# Altium schematic sheet Instrumentation_Amp.SchDoc
size A4; SheetNumber: 3; SheetTotal: 7
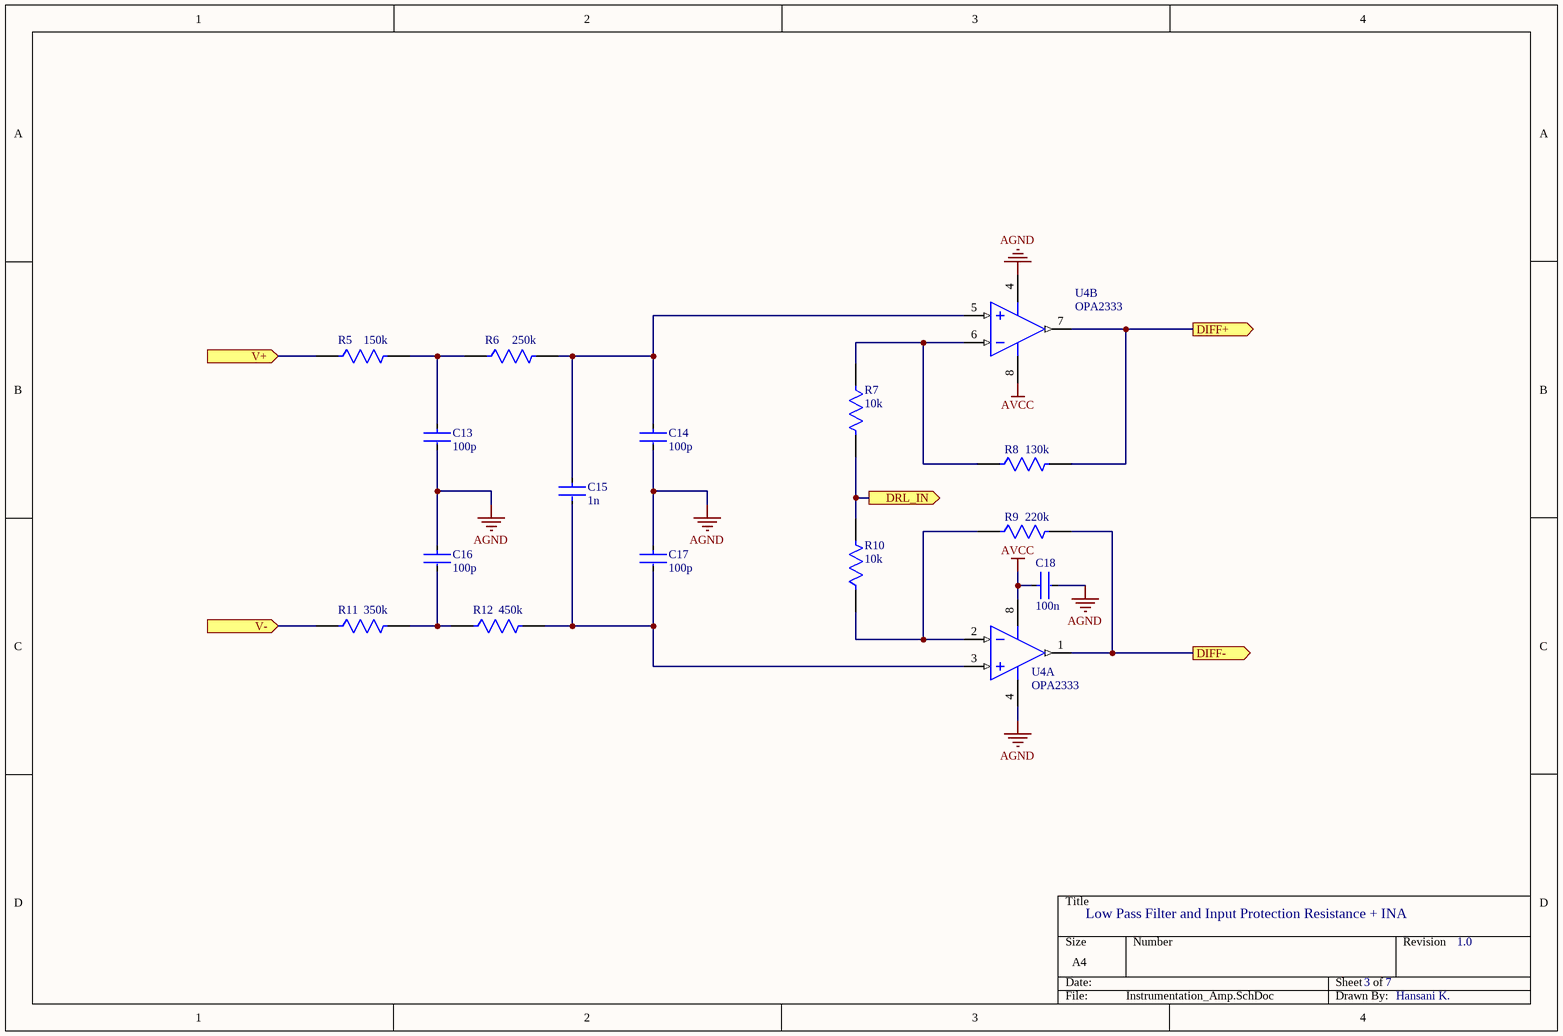
[diagram p0: Instrumentation_Amp.SchDoc]

## Parts
C13  100p  [FP-CC0805-0_1-0_7-IPC_A]
C14  100p  [FP-CC0805-0_1-0_7-IPC_A]
C15  1n  [PCBComponent_1]
C16  100p  [FP-CC0805-0_1-0_7-IPC_A]
C17  100p  [FP-CC0805-0_1-0_7-IPC_A]
C18  100n  [FP-GRM155-0_05-MFG]
R5  150k  [PCBComponent_1]
R6  250k  [PCBComponent_1]
R7  10k  [FP-AT0805-MFG]
R8  130k  [FP-RN732A-MFG]
R9  220k  [FP-CRCW0805-e3-IPC_B]
R10  10k  [FP-AT0805-MFG]
R11  350k  [PCBComponent_1]
R12  450k  [PCBComponent_1]
U4  OPA2333  [DGK0008A_M]  (parts A,B of 2)

## Ports
DIFF+ (out, see Wireless_ECG_Monitor[2B], Input_Driver_ADC[1B]), DIFF- (out, see Wireless_ECG_Monitor[2B], Input_Driver_ADC[1C]), DRL_IN (out, see Wireless_ECG_Monitor[2B], DRL_Circuit[2C]), V+ (in, see Wireless_ECG_Monitor[1B]), V- (in, see Wireless_ECG_Monitor[1B])

## Nets
AGND: C13.2 C14.2 C16.1 C17.1 C18.2 U4.4(V-)
AVCC: C18.1 U4.8(V+)
DIFF+: R8.2 U4.7(OUT_B) ; port DIFF+
DIFF-: R9.2 U4.1(OUT_A) ; port DIFF-
DRL_IN: R7.2 R10.2 ; port DRL_IN
V+: R5.1 ; port V+
V-: R11.1 ; port V-
NetC13_1: C13.1 R5.2 R6.1
NetC14_1: C14.1 C15.1 R6.2 U4.5(IN_B+)
NetC15_2: C15.2 C17.2 R12.2 U4.3(IN_A+)
NetC16_2: C16.2 R11.2 R12.1
NetR7_1: R7.1 R8.1 U4.6(IN_B-)
NetR9_1: R9.1 R10.1 U4.2(IN_A-)

## Notes on the sheet
- Low Pass Filter and Input Protection Resistance + INA
- 3
- 7
- 1.0
- Hansani K.

## Library data of the parts
C13 C14 C16 C17 = CMP-03422-001508-1: CAP CER 100PF 50V C0G/NPO 0805; Insulation Resistance: 100GR; Dielectric: C0G; Temperature Coefficient: 30ppm/°C; Dielectric Material: Ceramic; Tolerance: 5%; REACH SVHC: No SVHC; Packaging: Tape and Reel; Max Operating Temperature: 125°C; Case Code (Imperial): 0805; Number of Pins: 2; Height: 0.6mm; Case/Package: 0805; Resistor Type: Ceramic; Length: 2mm; Width: 1.25mm; RoHS Compliant: Yes; Thickness: 0.024inch; Case Code (Metric): 2012; Radiation Hardening: No; Series: CC; Package Quantity: 1; Voltage: 50V; Voltage Rating (DC): 50V; Capacitance: 100pF; Mount: Surface Mount; Voltage Rating: 50V; Min Operating Temperature: -55°C; Lead Free: Lead Free; Termination: SMD/SMT; Depth: 1.25mm
C15 = CS0805KRX7RBBB102: Ceramic Capacitor, Multilayer, Ceramic, 500V, 10% +Tol, 10% -Tol, X7R, 15% TC, 0.001uF, Surface Mount, 0805; Manufacturer: Yageo Group; Value: 1nF; Supplier: DigiKey; Supplier Part Number: 311-3593-1-ND; Manufacturer Part Number: CS0805KRX7RBBB102; RoHS: Compliant; Category: Ceramic Capacitors; Stock: 13349; Pricing: 1=0.32, 10=0.191, 50=0.14, 100=0.1241, 500=0.0976, 1000=0.08941 (USD); Case/Package: 0805; China RoHS: Compliant; Dielectric Material: Ceramic; Features: Soft Termination; Height: 850µm; Length: 2mm; Lifecycle Status: Production; Max Operating Temperature: 125°C; Min Operating Temperature: -55°C; Mounting Technology: Surface Mount; Number of Terminals: 2; REACH SVHC: Yes; Thickness: 990.6µm; Tolerance: 10%; Voltage Rating: 500V; Voltage Rating (DC): 500V; Width: 1.25mm; ComponentLink1URL: https://datasheet.octopart.com:443/CS0805KRX7RBBB102-Yageo-datasheet-176133326.pdf?src-supplier=IHS; ComponentLink1Description: https://datasheet.octopart.com:443/CS0805KRX7RBBB102-Yageo-datasheet-176133326.pdf?src-supplier=IHS; ComponentLink2URL: https://datasheet.octopart.com:443/CS0805KRX7RBBB102-Yageo-datasheet-158410602.pdf?src-supplier=Newark; ComponentLink2Description: https://datasheet.octopart.com:443/CS0805KRX7RBBB102-Yageo-datasheet-158410602.pdf?src-supplier=Newark; ComponentLink3URL: https://datasheet.octopart.com:443/CS0805KRX7RBBB102-Yageo-datasheet-182050863.pdf?src-supplier=Newark; ComponentLink3Description: https://datasheet.octopart.com:443/CS0805KRX7RBBB102-Yageo-datasheet-182050863.pdf?src-supplier=Newark; ComponentLink4URL: http://sigma.octopart.com:80/rohs_statement/Yageo-company-2.pdf?src-supplier=Compliance+Statements; ComponentLink4Description: http://sigma.octopart.com:80/rohs_statement/Yageo-company-2.pdf?src-supplier=Compliance+Statements; ComponentLink5URL: http://sigma.octopart.com:80/conflict_mineral_statement/Yageo-company-3.pdf?src-supplier=Compliance+Statements; ComponentLink5Description: http://sigma.octopart.com:80/conflict_mineral_statement/Yageo-company-3.pdf?src-supplier=Compliance+Statements
C18 = CMP-06035-040303-1: Chip Multilayer Ceramic Capacitors for General Purpose, 0402, 0.10uF, B, 10%, 20%, 50V
R5 R11 = ERJ-6GEYJ354V: ERJ Thick Film Chip Resistor 0805 350K Ohm 5% 0.125 W 2-Pin Surface Mount Punched Carrier T/R; Manufacturer: Panasonic; Max Power Dissipation: 125mW; Value: 350kΩ; Temperature Coefficient: 200ppm/°C; Supplier: DigiKey; Supplier Part Number: ERJ-6GEYJ354V-ND; Manufacturer Part Number: ERJ-6GEYJ354V; RoHS: Compliant; Category: Chip SMD Resistors; Pricing: 50000=0.00673 (USD); Case/Package: 0805; Composition: Thick Film; Contact Plating: Tin; Features: Automotive AEC-Q200; Height: 711.2µm; Length: 2.0066mm; Max Operating Temperature: 155°C; Min Operating Temperature: -55°C; Number of Terminations: 2; Packaging: Tape & Reel; Power Rating: 125mW; Radiation Hardening: No; Tolerance: 5%; Width: 1.2446mm; ComponentLink1URL: https://datasheet.octopart.com/ERJ-6GEYJ354V-Panasonic-datasheet-78375410.pdf; ComponentLink1Description: https://datasheet.octopart.com/ERJ-6GEYJ354V-Panasonic-datasheet-78375410.pdf; ComponentLink2URL: https://datasheet.octopart.com/Thick-Film-Chip-Resistors-Panasonic-datasheet-family-105.pdf; ComponentLink2Description: https://datasheet.octopart.com/Thick-Film-Chip-Resistors-Panasonic-datasheet-family-105.pdf
R6 = RNCF0805BTE250K: RNCF Precision Thin Film Chip Resistor 0805 Size 250K Ohm 0.1% 0.25 W 25 ppm/°C 2-Pin SMD T/R; Manufacturer: Stackpole Electronics; Power Dissipation: 125mW; Power Rating: 100mW; Value: 250kΩ; Working Voltage: 150V; Supplier: DigiKey; Supplier Part Number: 738-RNCF0805BTE250KCT-ND; Manufacturer Part Number: RNCF0805BTE250K; RoHS: Compliant; Category: Chip SMD Resistors; Stock: 8430; Pricing: 1=0.12, 10=0.087, 25=0.0852, 50=0.083, 100=0.077, 250=0.07292, 500=0.06918 (USD); Case/Package: 0805; China RoHS: Compliant; Height: 500µm; Lifecycle Status: Production; Max Operating Temperature: 155°C; Min Operating Temperature: -55°C; Mounting Technology: Surface Mount; Number of Terminals: 2; REACH SVHC: Yes; Temperature Coefficient: 25ppm/°C; Tolerance: 0.1%; Width: 1.25mm; ComponentLink1URL: https://datasheet.octopart.com:443/RNCF0805BTE250K-Stackpole-Electronics-datasheet-141158876.pdf?src-supplier=Stackpole+Electronics; ComponentLink1Description: https://datasheet.octopart.com:443/RNCF0805BTE250K-Stackpole-Electronics-datasheet-141158876.pdf?src-supplier=Stackpole+Electronics; ComponentLink2URL: https://datasheet.octopart.com:443/RNCF0805BTE250K-Stackpole-Electronics-datasheet-12511394.pdf?src-supplier=Stackpole+Electronics; ComponentLink2Description: https://datasheet.octopart.com:443/RNCF0805BTE250K-Stackpole-Electronics-datasheet-12511394.pdf?src-supplier=Stackpole+Electronics; ComponentLink3URL: https://datasheet.octopart.com:443/RNCF0805BTE250K-Stackpole-Electronics-datasheet-182148138.pdf?src-supplier=IHS; ComponentLink3Description: https://datasheet.octopart.com:443/RNCF0805BTE250K-Stackpole-Electronics-datasheet-182148138.pdf?src-supplier=IHS; ComponentLink4URL: https://datasheet.octopart.com/RNCF0805BTE250K-Stackpole-Electronics-datasheet-11755897.pdf; ComponentLink4Description: https://datasheet.octopart.com/RNCF0805BTE250K-Stackpole-Electronics-datasheet-11755897.pdf; ComponentLink5URL: http://sigma.octopart.com:80/15941409/materials_sheet/Stackpole-Electronics-RNCF0805BTE250K.pdf?src-supplier=Compliance+Statements; ComponentLink5Description: http://sigma.octopart.com:80/15941409/materials_sheet/Stackpole-Electronics-RNCF0805BTE250K.pdf?src-supplier=Compliance+Statements; ComponentLink6URL: http://sigma.octopart.com:80/141158211/reach_statement/Stackpole-Electronics-RNCF0805BTE250K.pdf?src-supplier=Compliance+Statements; ComponentLink6Description: http://sigma.octopart.com:80/141158211/reach_statement/Stackpole-Electronics-RNCF0805BTE250K.pdf?src-supplier=Compliance+Statements; ComponentLink7URL: http://sigma.octopart.com:80/141158212/rohs_statement/Stackpole-Electronics-RNCF0805BTE250K.pdf?src-supplier=Compliance+Statements; ComponentLink7Description: http://sigma.octopart.com:80/141158212/rohs_statement/Stackpole-Electronics-RNCF0805BTE250K.pdf?src-supplier=Compliance+Statements
R7 R10 = CMP-03412-049031-1: Thin Film Chip Resistors Automotive Grade 10kΩ 0.5% 50ppm/°C 0805; Max Power Dissipation: 125mW; Resistance: 10kR; Ratings: AEC-Q200; Length: 0.079inch; Temperature Coefficient: 50ppm/°C; Height: 0.024inch; Min Operating Temperature: -55°C; Case/Package: 0805; Tolerance: 0.5%; RoHS Compliant: Yes; Features: Moisture Resistant; Number of Terminations: 2; Max Operating Temperature: 155°C; Series: AT; Packaging: Tape and Reel; Width: 0.049inch; Resistor Type: Thin Film
R8 = CMP-03211-005013-1: SMD Chip Resistor, Thin Film, 130KΩ, 100 V, 0805 [2012 Metric], 100 mW, 0.1%, RN73 Series; Manufacturer: TE Connectivity; Manufacturer Part Number: RN73C2A130KB; Voltage Rating: 100V; Temperature Coefficient: 10ppm/°C; Power Rating: 0.1W; Temperature: -55°C to 155°C; Device Class L3: Chip SMD Resistors; octopart_url: https://octopart.com/rn73c2a130kb-te+connectivity-47108236; Device Class L1: Passive Components; Ipc Land Pattern Name: RESC200125X55; Composition: Thin Film; Resistance: 130KΩ; ComponentLink2Description: Datasheet; RoHS: TRUE; Automotive: No; Temperature Range Low: -55°C; Tolerance: 0.1%; Category: Res; Value: 130KΩ; Temperature Range High: 155°C; ComponentLink2URL: https://www.te.com/commerce/DocumentDelivery/DDEController?Action=showdoc&DocId=Data+Sheet%7F1773270%7FP%7Fpdf%7FEnglish%7FENG_DS_1773270_P.pdf%7F1676162-2; Device Class L2: Resistors; Series: RN73; Height: 0.65mm; Package: RN732A; Lead Free: Yes; Octopart: https://octopart.com/rn73c2a130kb-te+connectivity-47108236; packaging: Custom
R9 = CMP-02407-007376-1: RES Thick Film, 220kΩ, 1%, 0.125W, 100ppm/°C, 0805; Max Power Dissipation: 125mW; Resistance: 220kR; Width: 0.049inch; Composition: Thick Film; Max Operating Temperature: 155°C; Min Operating Temperature: -55°C; Length: 0.079inch; Package Quantity: 20000; Features: Automotive AEC-Q200; Packaging: Tape and Reel; Height: 0.02inch; Case/Package: 0805; Temperature Coefficient: 100ppm/°C; Lead Free: Lead Free; Number of Terminations: 2; Tolerance: 1%
R12 = RMK55N450KB: Rmk 55N 450K 0, 1% E /Waffle Pack |Vishay RMK55N450KB; Manufacturer: Vishay; Supplier: DigiKey; Supplier Part Number: 716-RMK55N450KB-ND; Manufacturer Part Number: RMK55N450KB; Category: Chip SMD Resistors; Pricing: 100=17.6562 (USD); RoHS: Non-Compliant; ComponentLink1URL: http://sigma.octopart.com:80/rohs_statement/Vishay-company-15.pdf?src-supplier=Compliance+Statements; ComponentLink1Description: http://sigma.octopart.com:80/rohs_statement/Vishay-company-15.pdf?src-supplier=Compliance+Statements
U4 = CMP-0272-01196-3: 17 uA, MicroPower, Precision, Zero Drift CMOS Operational Amplifier, 1.8 to 5.5 V, -40 to 125 degC, 8-pin SOP (DGK8), Green (RoHS & no Sb/Br); Manufacturer: Texas Instruments; PartNumber: OPA2333AIDGKR; CMRR(Min)(dB): 106; IIB(Max)(pA): 200; Slew Rate(Typ)(V/us): 0.16; Sub Family: Low Offset Voltage Amplifier (<=500uV), Low Power Amp (<=500uA), Low Supply Voltage Amplifier (<=2.7V), Precision Amplifier, Zero Drift Precision Amplifier; Total Supply Voltage(Min)(+5V is 5, +/-5V is 10): 1.8; Total Supply Voltage(Max)(+5V is 5, +/-5V is 10): 5.5; Offset Drift(Typ)(uV/C): 0.02; Number of Channels: 2; Iq per channel(Max)(mA): 0.025; Vio (25C)(Max)(mV): 0.01; PackageVersion: 4073329/E, 05/2006; ComponentLink3URL: http://www.ti.com/litv/pdf/mpds028d; Eco-Plan: Green (RoHS & no Sb/Br); ComponentLink2URL: http://www.ti.com/general/docs/lit/getliterature.tsp?genericPartNumber=OPA2333&fileType=pdf; Mounting Technology: Surface Mount; PackageDescription: 8-Pin Thin Small Outline, Body 3 x 3 mm, Pitch 0.65 mm; DatasheetVersion: SBOS351C; ComponentLink1Description: Manufacturer URL; Code_JEDEC: MO-187; ComponentLink3Description: Package Specification; ComponentLink1URL: http://www.ti.com/; ComponentLink2Description: Datasheet; PackageReference: DGK0008A